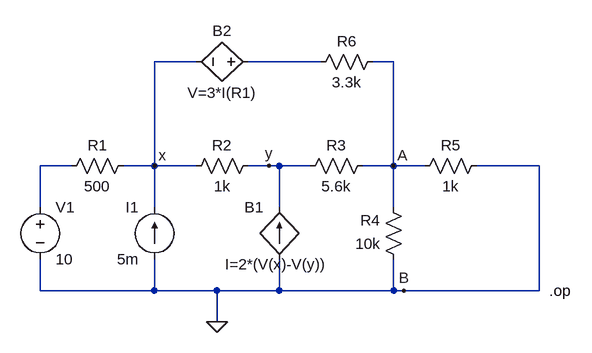
[diagram p0: schematic Circuit 6.asc]
Circuit 6.asc, the LTspice schematic file:
Version 4
SHEET 1 880 680
WIRE 256 -80 192 -80
WIRE 448 -80 336 -80
WIRE 560 -80 528 -80
WIRE 64 80 16 80
WIRE 192 80 192 -80
WIRE 192 80 144 80
WIRE 256 80 192 80
WIRE 368 80 336 80
WIRE 384 80 368 80
WIRE 432 80 384 80
WIRE 560 80 560 -80
WIRE 560 80 512 80
WIRE 608 80 560 80
WIRE 784 80 688 80
WIRE 16 144 16 80
WIRE 192 144 192 80
WIRE 384 144 384 80
WIRE 560 144 560 80
WIRE 16 272 16 224
WIRE 192 272 192 224
WIRE 192 272 16 272
WIRE 288 272 192 272
WIRE 384 272 384 224
WIRE 384 272 288 272
WIRE 560 272 560 224
WIRE 560 272 384 272
WIRE 576 272 560 272
WIRE 784 272 784 80
WIRE 784 272 576 272
WIRE 288 320 288 272
FLAG 288 320 0
FLAG 192 80 x
FLAG 368 80 y
FLAG 560 80 A
FLAG 576 272 B
SYMBOL voltage 16 128 R0
SYMATTR InstName V1
SYMATTR Value 10
SYMBOL current 192 224 R180
WINDOW 0 24 80 Left 2
WINDOW 3 24 0 Left 2
SYMATTR InstName I1
SYMATTR Value 5m
SYMBOL res 160 64 R90
WINDOW 0 0 56 VBottom 2
WINDOW 3 32 56 VTop 2
SYMATTR InstName R1
SYMATTR Value 500
SYMBOL res 240 96 R270
WINDOW 0 32 56 VTop 2
WINDOW 3 0 56 VBottom 2
SYMATTR InstName R2
SYMATTR Value 1k
SYMBOL res 528 64 R90
WINDOW 0 0 56 VBottom 2
WINDOW 3 32 56 VTop 2
SYMATTR InstName R3
SYMATTR Value 5.6k
SYMBOL res 592 96 R270
WINDOW 0 32 56 VTop 2
WINDOW 3 0 56 VBottom 2
SYMATTR InstName R5
SYMATTR Value 1k
SYMBOL res 576 240 R180
WINDOW 0 36 76 Left 2
WINDOW 3 36 40 Left 2
SYMATTR InstName R4
SYMATTR Value 10k
SYMBOL res 432 -64 R270
WINDOW 0 32 56 VTop 2
WINDOW 3 0 56 VBottom 2
SYMATTR InstName R6
SYMATTR Value 3.3k
SYMBOL bv 352 -80 R90
WINDOW 0 -32 56 VBottom 2
WINDOW 3 32 56 VTop 2
SYMATTR InstName B2
SYMATTR Value V=3*I(R1)
SYMBOL bi 384 224 R180
WINDOW 0 24 80 Left 2
WINDOW 3 -73 -7 Left 2
SYMATTR InstName B1
SYMATTR Value I=2*(V(x)-V(y))
TEXT 800 272 Left 2 !.op

The netlist it stands for:
* Circuit 6.asc
V1 N002 0 10
I1 0 x 5m
R1 x N002 500
R2 x y 1k
R3 A y 5.6k
R5 A 0 1k
R4 0 A 10k
R6 N001 A 3.3k
B2 N001 x V=3*I(R1)
B1 0 y I=2*(V(x)-V(y))
.op
.backanno
.end